# Altium schematic sheet TermperatureSens.SchDoc: FPGA Motherboard for Digital Multiplexed Readout, McGill U.
size Letter; DocumentNumber: DfMUX18; Revision: Rev0, Prototype; SheetNumber: 18; SheetTotal: 27; PageSetup: Record=PageOptions|CenterHorizontal=True|CenterVertical=True|PrintScale=0.93|XCorrection=1.00|YCorrection=1.00|PrintKind=0|BorderSize=5000000|LeftOffset=0|BottomOffset=0|Orientation=2|PaperLength=1000|PaperWidth=1000|Scale=100|PaperSource=7|PrintQuality=-4|MediaType=1|DitherType=10|PaperKind=Letter|PrintScaleMode=1
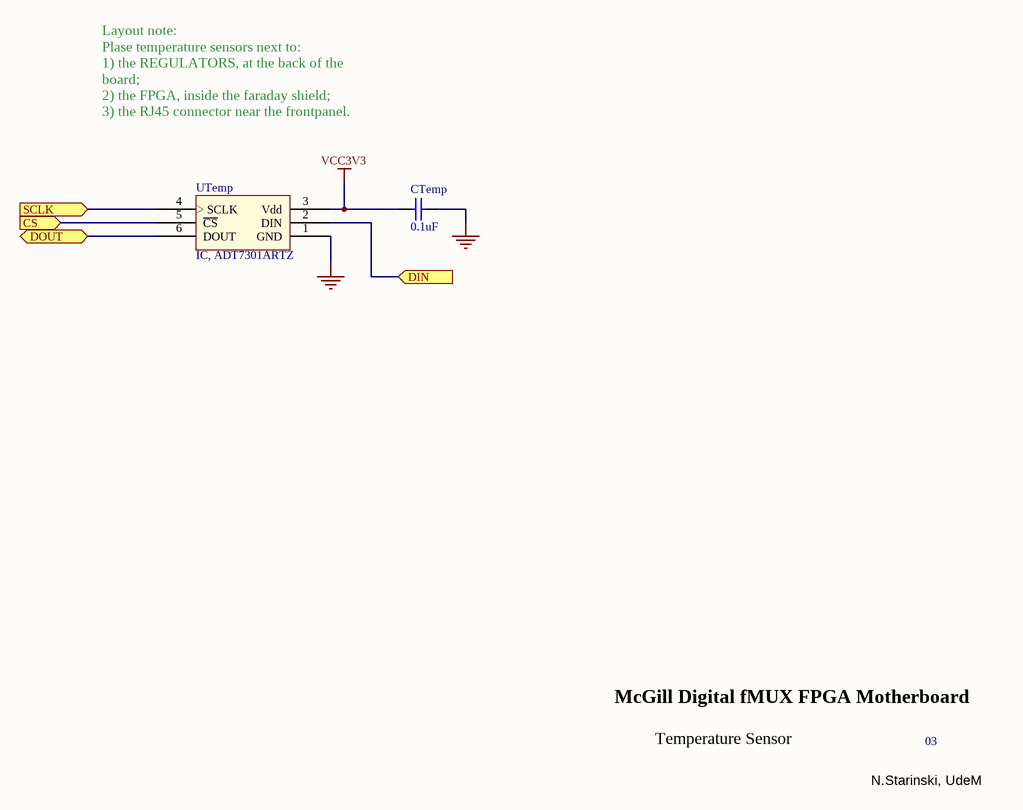
[diagram p0: TermperatureSens.SchDoc]

## Parts
CTemp  0.1uF  [CC1608-0603]
UTemp  IC, ADT7301ARTZ  [SO-G6/E2.4]

## Ports
CS (in), DIN (in), DOUT (bidir), SCLK (in)

## Nets
GND: CTemp.2 UTemp.1(GND)
VCC3V3: CTemp.1 UTemp.3(Vdd)
CS: UTemp.5(~{CS}) ; port CS
DIN: UTemp.2(DIN) ; port DIN
DOUT: UTemp.6(DOUT) ; port DOUT
SCLK: UTemp.4(SCLK) ; port SCLK

## Notes on the sheet
- Layout note:
  Plase temperature sensors next to:
  1) the REGULATORS, at the back of the board;
  2) the FPGA, inside the faraday shield;
  3) the RJ45 connector near the frontpanel.
- McGill Digital fMUX FPGA Motherboard
- Temperature Sensor
- 03
- N.Starinski, UdeM

## Library data of the parts
CTemp = Cap Semi: Capacitor (Semiconductor SIM Model); Published: 8-Jun-2000; LatestRevisionDate: 17-Jul-2002; LatestRevisionNote: Re-released for DXP Platform.; PackageReference: C1206; Publisher: Altium Limited
UTemp = ADT7301: Digital Temperature Sensor, 13-Bit, +/-1 Degree Accurate